# Altium project Zenith 2U.PrjPcb
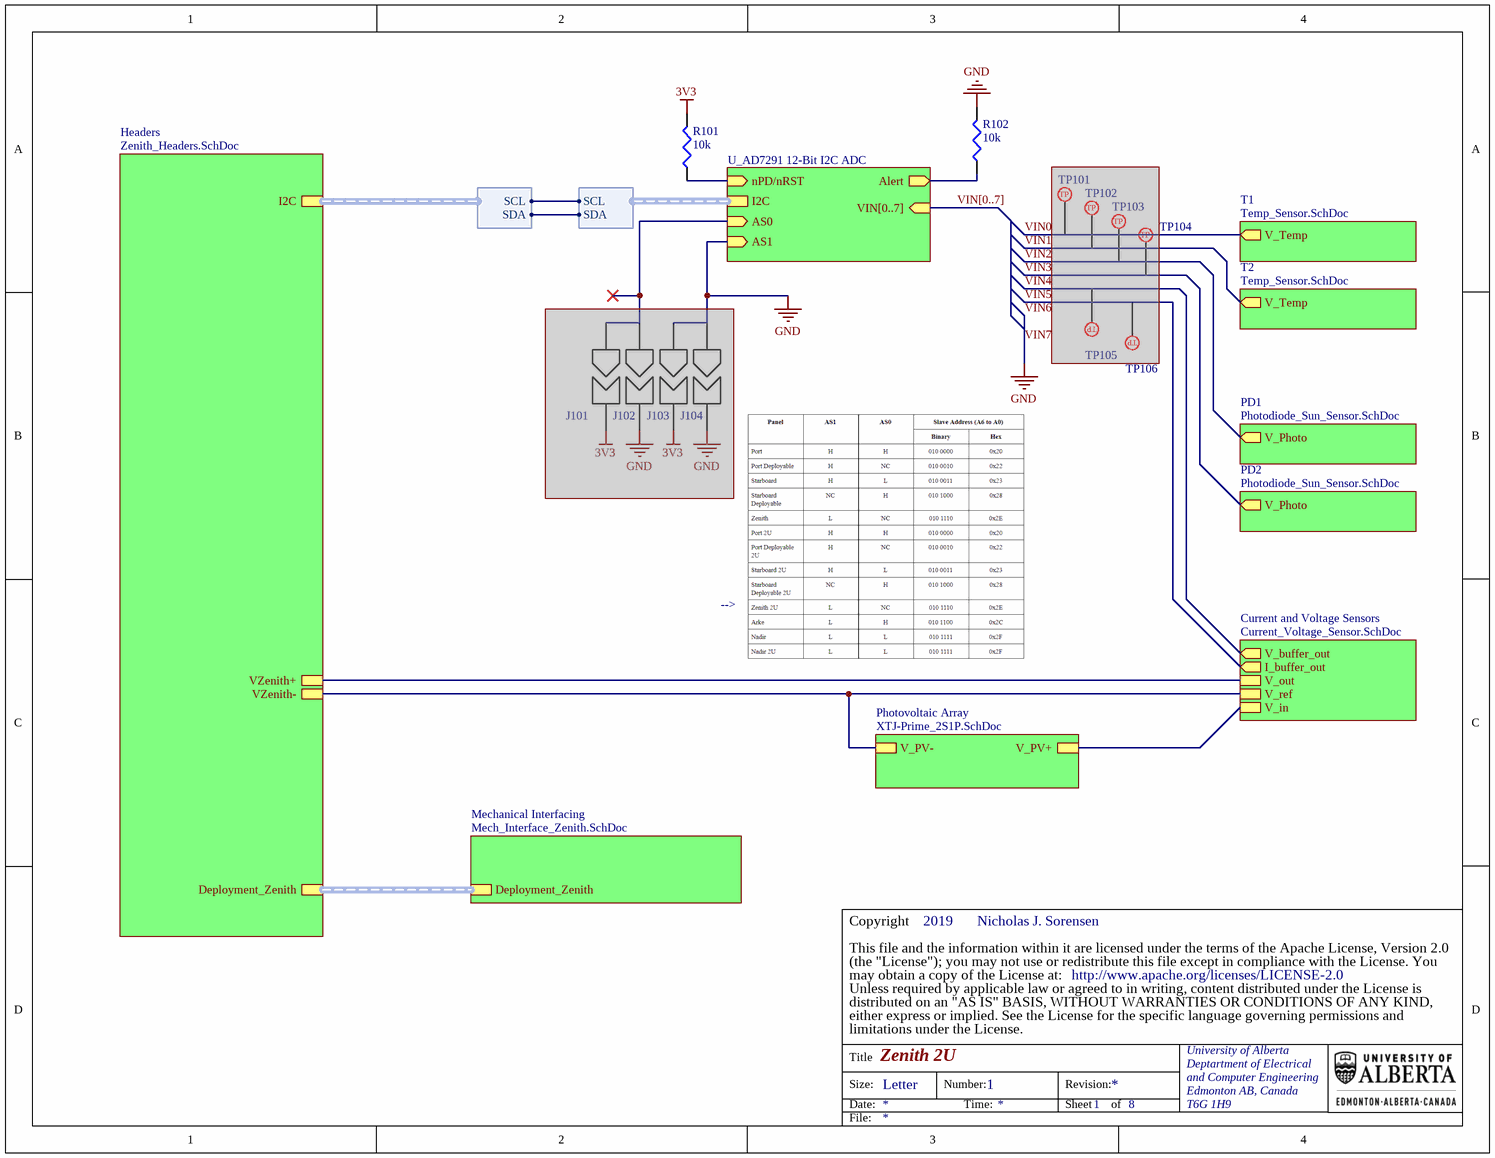
[diagram p0: Zenith 2U.SchDoc]
ProjectVersion: 4.02; SVNVersion: 3196
3 sheets, 30 parts. Net scope: hierarchical (ports join the sheet entries above them; power ports are global).
Board file: Zenith Solar Panel 2U.PcbDoc
Sheets:
  Zenith 2U.SchDoc
    Mechanical Interfacing = Mech_Interface_Zenith.SchDoc
    Headers = Zenith_Headers.SchDoc

## Sheet Zenith 2U.SchDoc: Zenith 2U
size Letter; Author: Nicholas J. Sorensen; DocumentNumber: 1; SheetNumber: 1; SheetTotal: 8; CopyrightYear: 2019

### Parts
J101  Jumping Pad  [Jumping Pad]  (value not drawn)  (masked out: inside a compile mask, not in the netlist)
J102  Jumping Pad  [Jumping Pad]  (value not drawn)  (masked out: inside a compile mask, not in the netlist)
J103  Jumping Pad  [Jumping Pad]  (value not drawn)  (masked out: inside a compile mask, not in the netlist)
J104  Jumping Pad  [Jumping Pad]  (value not drawn)  (masked out: inside a compile mask, not in the netlist)
R101  value 10k  [VSH-0603MCT]  (hidden comment: Res3)
R102  value 10k  [VSH-0603MCT]  (hidden comment: Res3)
TP101  5017  [KS-5017]  (value not drawn)  (masked out: inside a compile mask, not in the netlist)
TP102  5017  [KS-5017]  (value not drawn)  (masked out: inside a compile mask, not in the netlist)
TP103  5017  [KS-5017]  (value not drawn)  (masked out: inside a compile mask, not in the netlist)
TP104  5017  [KS-5017]  (value not drawn)  (masked out: inside a compile mask, not in the netlist)
TP105  5017  [KS-5017]  (value not drawn)  (masked out: inside a compile mask, not in the netlist)
TP106  5017  [KS-5017]  (value not drawn)  (masked out: inside a compile mask, not in the netlist)

### Sub-sheets
Current and Voltage Sensors = Current_Voltage_Sensor.SchDoc (file not in this document): V_out, V_ref, V_in, I_buffer_out (out), V_buffer_out (out)
Headers = Zenith_Headers.SchDoc: I2C (harness I2C), VZenith+, Deployment_Zenith (harness Deployment_Zenith), VZenith-
Mechanical Interfacing = Mech_Interface_Zenith.SchDoc: Deployment_Zenith (harness Deployment_Zenith)
PD1 = Photodiode_Sun_Sensor.SchDoc (file not in this document): V_Photo (out)
PD2 = Photodiode_Sun_Sensor.SchDoc (file not in this document): V_Photo (out)
Photovoltaic Array = XTJ-Prime_2S1P.SchDoc (file not in this document): V_PV+, V_PV-
T1 = Temp_Sensor.SchDoc (file not in this document): V_Temp (out)
T2 = Temp_Sensor.SchDoc (file not in this document): V_Temp (out)
U_AD7291 12-Bit I2C ADC = AD7291 12-Bit I2C ADC.SchDoc (file not in this document): nPD/nRST (in), Alert (out), VIN[0..7] (in), AS0 (in), AS1 (in), I2C (harness I2C)

### Harnesses
I2C: SCL, SDA

### Nets
3V3: R101.2
VIN6: R102.2 ; sheet U_AD7291 12-Bit I2C ADC/AS1  [also labelled GND, VIN7]
SCL: sheet U_AD7291 12-Bit I2C ADC/I2C.SCL, sheet Headers/I2C.SCL
SDA: sheet U_AD7291 12-Bit I2C ADC/I2C.SDA, sheet Headers/I2C.SDA
VIN0: sheet T1/V_Temp
VIN1: sheet T2/V_Temp
VIN2: sheet PD1/V_Photo
VIN3: sheet PD2/V_Photo
VIN4: sheet Current and Voltage Sensors/V_buffer_out
VIN5: sheet Current and Voltage Sensors/I_buffer_out
NetP803_1: sheet Photovoltaic Array/V_PV-, sheet Current and Voltage Sensors/V_ref, sheet Headers/VZenith-
NetP803_3: sheet Current and Voltage Sensors/V_out, sheet Headers/VZenith+
NetR101_1: R101.1 ; sheet U_AD7291 12-Bit I2C ADC/nPD/nRST
NetR102_1: R102.1 ; sheet U_AD7291 12-Bit I2C ADC/Alert
(unnamed): sheet Photovoltaic Array/V_PV+, sheet Current and Voltage Sensors/V_in

### Buses and harness runs
bus VIN[0..7] = sheet U_AD7291 12-Bit I2C ADC/VIN[0..7]
harness sheet Headers/Deployment_Zenith = sheet Mechanical Interfacing/Deployment_Zenith

### Notes on the sheet
- -->
- (the "License"); you may not use or redistribute this file except in compliance with the License. You
- This file and the information within it are licensed under the terms of the Apache License, Version 2.0
- Copyright
- Unless required by applicable law or agreed to in writing, content distributed under the License is
- distributed on an "AS IS" BASIS, WITHOUT WARRANTIES OR CONDITIONS OF ANY KIND,
- either express or implied. See the License for the specific language governing permissions and
- limitations under the License.
- may obtain a copy of the License at:
- http://www.apache.org/licenses/LICENSE-2.0
- Title
- Size:
- Date:
- Letter
- Number:
- Time:
- Revision:
- Sheet
- of
- University of Alberta
- Deptartment of Electrical
- and Computer Engineering
- Edmonton AB, Canada
- T6G 1H9
- File:
- (in symbol PTP-KS-00001) TP

### Library data of the parts
J101-J104 = PXX-ABS-00011: Manufacturer Part Number: Custom; Index: 11; Designator: J?; Part Number: PXX-ABS-00011; Supplier 1: Digi-key; Publisher: AlbertaSat; LatestRevisionNote: ...
R101 R102 = PR-VSH-00143: RES SMD 10K OHM 1% 1/8W 0603; Manufacturer Part Number: MCT06030C1002FP500; Index: 143; Designator: R?; Temperature Coefficient: ±50ppm/°C; Published: 3/14/2016; LatestRevisionDate: 3/14/2016; LatestRevisionNote: ...; PackageReference: 0603 (1608 Metric); Publisher: AlbertaSat; PackageDescription: Chip Resistor, 2-Leads, Body 1.55x0.85mm, IPC Low Density; Part Number: PR-VSH-00143; Supplier Part Number 1: MCT0603-10.0K-CFCT-ND; Supplier 1: Digi-key; Supplier Link: http://www.digikey.ca/product-search/en?keywords=MCT0603-10.0K-CFCT-ND; Tolerance: ±1%; Power - Rated: 1/8W; Applications: General Purpose
TP101-TP106 = PTP-KS-00001: PC TEST POINT MINI SMD; Index: 1; Supplier 1: Digi-key; Supplier 2: Newark; Supplier 3: Mouser; Part Number: PTP-KS-00001; Manufacturer Part Number: 5017; Supplier Part Number 1: 36-5017CT-ND; Publisher: AlbertaSat; Published: 3/15/2016; LatestRevisionDate: 3/15/2016; LatestRevisionNote: ...; PackageReference: KS-5017; PackageDescription: Testpoint Lug Mini SMD 27X10X152; Supplier Link: http://www.digikey.ca/product-detail/en/keystone-electronics/5017/36-5017TR-ND/2217304

## Sheet Mech_Interface_Zenith.SchDoc: Mech_Interface_Zenith
size Letter; Author: Nicholas J. Sorensen, and Erik F. Halliwell; Engineer: Nicholas J. Sorensen, and Erik F. Halliwell; DocumentNumber: 7; SheetNumber: 7; SheetTotal: 8
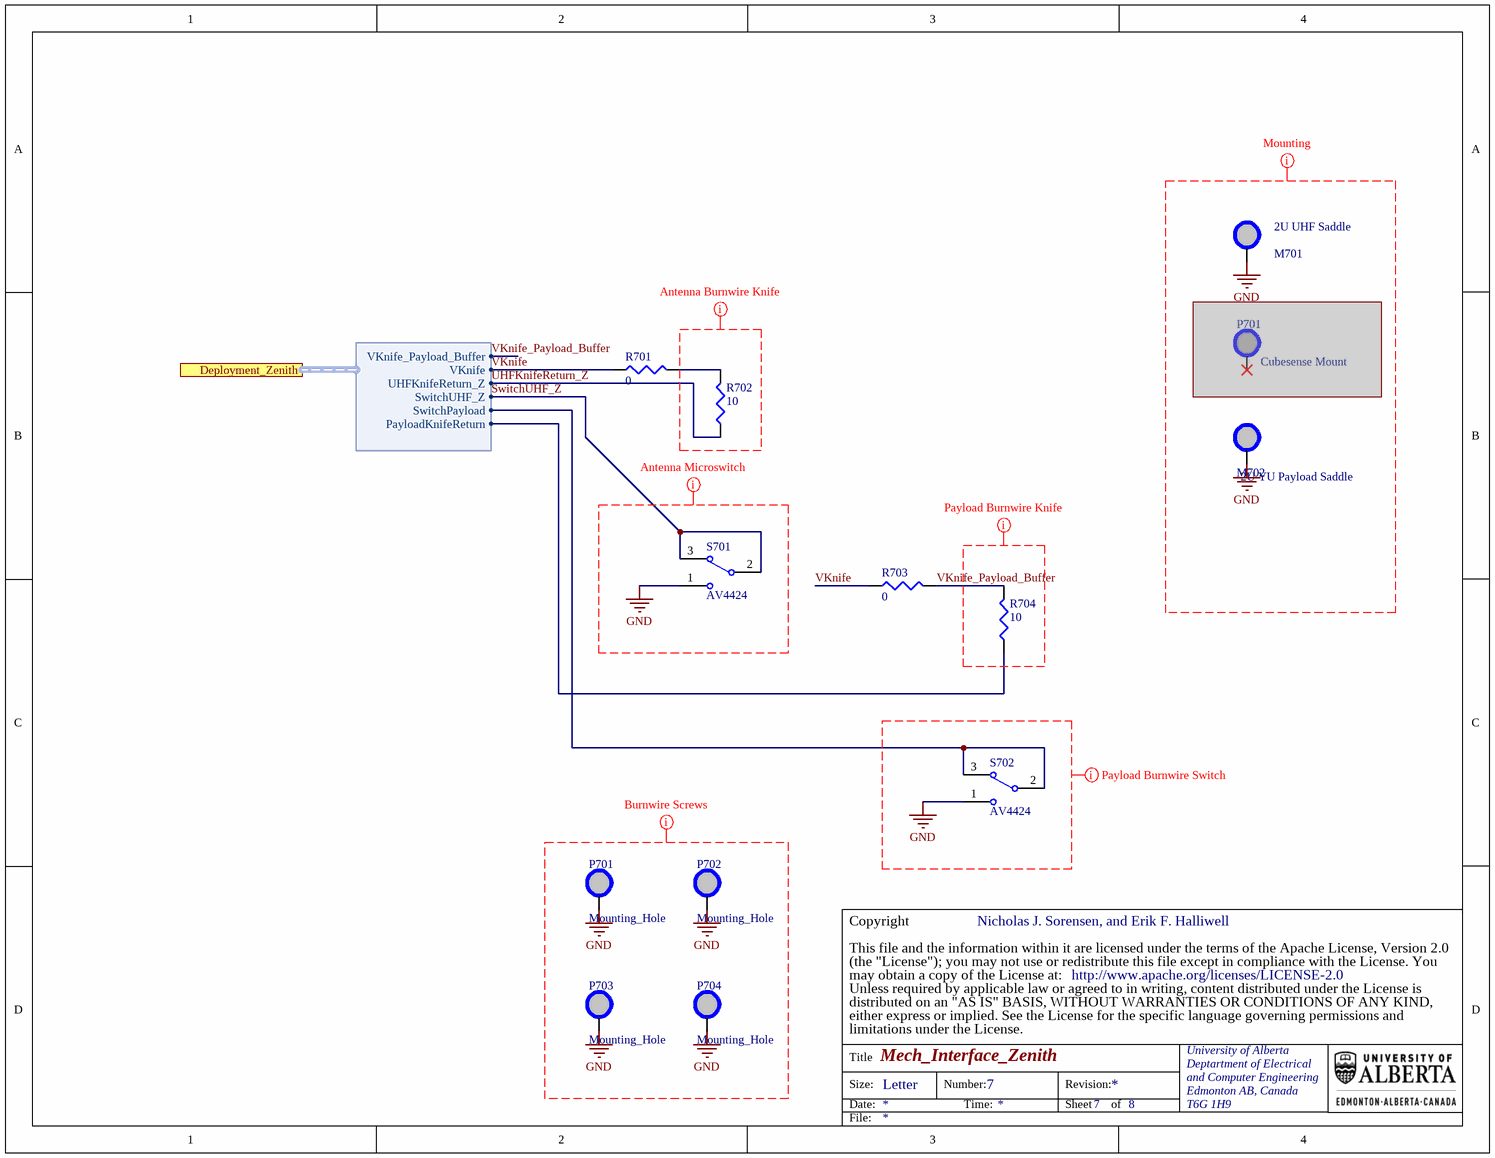
[diagram p1: Mech_Interface_Zenith.SchDoc]

### Parts
(Parts that share a designator on the sheet are numbered #1, #2 ... from top to bottom, then left to right.)
M701  2U UHF Saddle  [2U_ANTENNA_SADDLE]
M702  2U YU Payload Saddle  [2U_YU_Saddle]
P701#1  Cubesense Mount  [Cubesense_Mount]  (masked out: inside a compile mask, not in the netlist)
P701#2  Mounting_Hole  [Burnwire_Screw]
P702  Mounting_Hole  [Burnwire_Screw]
P703  Mounting_Hole  [Burnwire_Screw]
P704  Mounting_Hole  [Burnwire_Screw]
R701  value 0  [PANA-ERJ3G]  (hidden comment: Jumper)
R702  value 10  [VSH-CPF1]  (hidden comment: Res3)
R703  value 0  [PANA-ERJ3G]  (hidden comment: Jumper)
R704  value 10  [VSH-CPF1]  (hidden comment: Res3)
S701  AV4424  [PANA-AV4424]
S702  AV4424  [PANA-AV4424]

### Ports
Deployment_Zenith (harness Deployment_Zenith)

### Harnesses
Deployment_Zenith: UHFKnifeReturn_Z, VKnife, SwitchUHF_Z, SwitchPayload, PayloadKnifeReturn, VKnife_Payload_Buffer

### Nets
GND: M701.1 M702.1 P701#2.1 P702.1 P703.1 P704.1 S701.1(NO) S702.1(NO)  [project net VIN6]
PayloadKnifeReturn: R704.1 ; port Deployment_Zenith.PayloadKnifeReturn
SwitchPayload: S702.2(COM) S702.3(NC) ; port Deployment_Zenith.SwitchPayload
SwitchUHF_Z: S701.2(COM) S701.3(NC) ; port Deployment_Zenith.SwitchUHF_Z
UHFKnifeReturn_Z: R702.1 ; port Deployment_Zenith.UHFKnifeReturn_Z
VKnife: R701.1 R703.1 ; port Deployment_Zenith.VKnife
VKnife_Payload_Buffer: R703.2 R704.2 ; port Deployment_Zenith.VKnife_Payload_Buffer
NetR701_2: R701.2 R702.2

### Layout directives
mark named Antenna Burnwire Knife: (no net found under the mark)
mark named Antenna Microswitch: GND
mark named Mounting: GND
mark named Burnwire Screws: GND
mark named Payload Burnwire Knife: (no net found under the mark)
mark named Payload Burnwire Switch: GND

### Notes on the sheet
- (the "License"); you may not use or redistribute this file except in compliance with the License. You
- This file and the information within it are licensed under the terms of the Apache License, Version 2.0
- Copyright
- Unless required by applicable law or agreed to in writing, content distributed under the License is
- distributed on an "AS IS" BASIS, WITHOUT WARRANTIES OR CONDITIONS OF ANY KIND,
- either express or implied. See the License for the specific language governing permissions and
- limitations under the License.
- may obtain a copy of the License at:
- http://www.apache.org/licenses/LICENSE-2.0
- Title
- Size:
- Date:
- Letter
- Number:
- Time:
- Revision:
- Sheet
- of
- University of Alberta
- Deptartment of Electrical
- and Computer Engineering
- Edmonton AB, Canada
- T6G 1H9
- File:

### Library data of the parts
M701 = PXX-ABS-00012: Saddle for the UHF antennas to be seated in.; Manufacturer Part Number: Custom; Index: 13; Designator: M?; Part Number: PXX-ABS-00012; Supplier 1: Digi-key; Publisher: AlbertaSat; LatestRevisionNote: ...
M702 = PXX-ABS-00020: Manufacturer Part Number: Custom; Index: 20; Designator: M?; Part Number: PXX-ABS-00020; Supplier 1: Digi-key; Publisher: AlbertaSat; LatestRevisionNote: ...
P701#1 = PXX-ABS-00006: Manufacturer Part Number: Custom; Index: 6; Designator: P?; Part Number: PXX-ABS-00006; Supplier 1: Digi-key; Publisher: AlbertaSat; LatestRevisionNote: ...
P701#2 P702-P704 = PXX-ABS-00015: Manufacturer Part Number: Custom; Index: 15; Designator: M?; Part Number: PXX-ABS-00015; Supplier 1: Digi-key; Publisher: AlbertaSat; LatestRevisionNote: ...
R701 R703 = 13128: RES SMD 0.0OHM JUMPER 1/10W 0603; Part Number: 13128; Manufacturer Part Number: ERJ-3GEY0R00V; Designator: R?; Power: 0.1W, 1/10W; PackageDescription: Chip Resistor, 2-Leads, Body 1.60x0.80mm, IPC Low Density; Supplier Part Number 1: P0.0GCT-ND; Supplier 1: Digi-Key; Supplier Link: http://www.digikey.ca/product-search/en?keywords=P0.0GCT-ND; PackageReference: 0603 (1608 Metric); Tolerance: Jumper; Temperature Coefficient: -; Type: Jumper
R702 R704 = PR-VSH-00317: 21 Ohms ±1% 1W Through Hole Resistor Axial Flame Proof, Moisture Resistant, Safety Metal Film; Manufacturer Part Number: CPF121R000FKEE6; Index: 317; Designator: R?; Temperature Coefficient: ±100ppm/°C; Published: 2/27/2020; LatestRevisionDate: 2/27/2020; LatestRevisionNote: ...; PackageReference: VSH-CPF1; Publisher: AlbertaSat; PackageDescription: Chip Resistor; Part Number: PR-VSH-00317; Supplier Part Number 1: CPF21.0CCT-ND; Supplier 1: Digi-key; Supplier Link: #https://www.digikey.ca/product-detail/en/vishay-dale/CPF121R000FKEE6/CPF21.0CCT-ND/2713126#; Tolerance: ±1%; Power - Rated: 1W
S701 S702 = 20035: SWITCH SNAP ACT SPDT 500MA 30V; Part Number: 20035; Manufacturer Part Number: AV4424; Supplier Part Number 1: 255-3743-ND; Supplier 1: Digi-Key; Supplier Link: #https://www.digikey.com/product-detail/en/panasonic-electric-works/AV4424/255-3743-ND/646766#

## Sheet Zenith_Headers.SchDoc: Zenith_Headers
size Letter; Author: Nicholas J. Sorensen, and Erik F. Halliwell; Engineer: Nicholas J. Sorensen, and Erik F. HalliwellNicholas Sorensen, and Erik Halliwell; DocumentNumber: 8; SheetNumber: 8; SheetTotal: 8
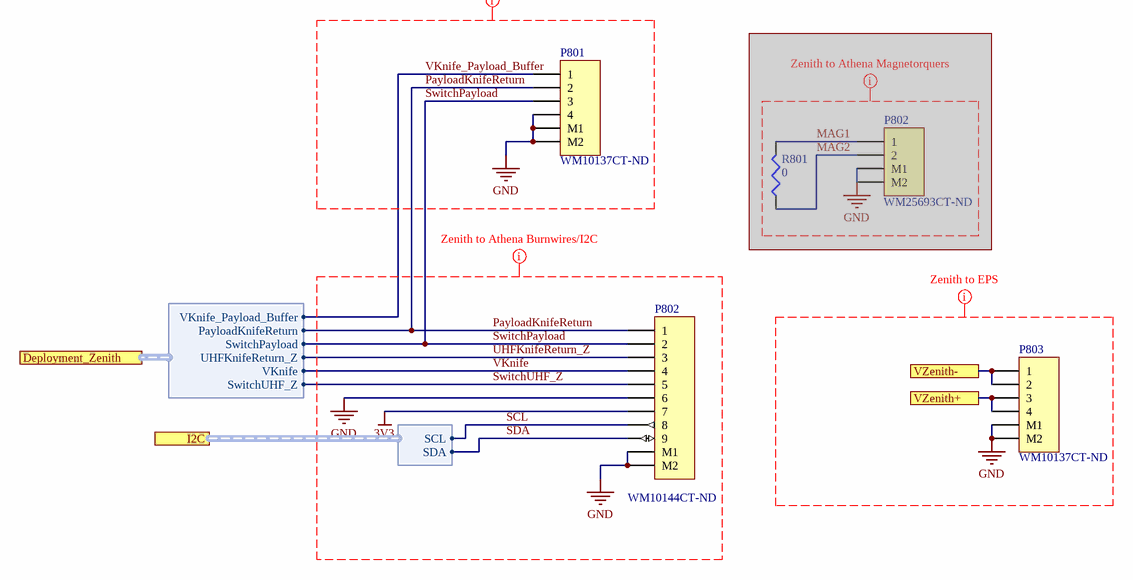
[diagram p2: Zenith_Headers.SchDoc]

### Parts
(Parts that share a designator on the sheet are numbered #1, #2 ... from top to bottom, then left to right.)
P801  WM10137CT-ND  [MOLX-5040500491]
P802#1  WM25693CT-ND  [MOLX-5040500291]  (masked out: inside a compile mask, not in the netlist)
P802#2  WM10144CT-ND  [MOLX-5040500991]
P803  WM10137CT-ND  [MOLX-5040500491]
R801  value 0  [VSH-0805MCU]  (hidden comment: Res3)  (masked out: inside a compile mask, not in the netlist)

### Ports
Deployment_Zenith (harness Deployment_Zenith), I2C (harness I2C), VZenith+, VZenith-

### Harnesses
Deployment_Zenith: UHFKnifeReturn_Z, VKnife, SwitchUHF_Z, SwitchPayload, PayloadKnifeReturn, VKnife_Payload_Buffer
I2C: SCL, SDA

### Nets
3V3: P802#2.7
GND: P801.4 P801.M1 P801.M2 P802#2.6 P802#2.M1 P802#2.M2 P803.M1 P803.M2  [project net VIN6]
PayloadKnifeReturn: P801.2 P802#2.1 ; port Deployment_Zenith.PayloadKnifeReturn
SCL: P802#2.8 ; port I2C.SCL
SDA: P802#2.9 ; port I2C.SDA
SwitchPayload: P801.3 P802#2.2 ; port Deployment_Zenith.SwitchPayload
SwitchUHF_Z: P802#2.5 ; port Deployment_Zenith.SwitchUHF_Z
UHFKnifeReturn_Z: P802#2.3 ; port Deployment_Zenith.UHFKnifeReturn_Z
VKnife: P802#2.4 ; port Deployment_Zenith.VKnife
VKnife_Payload_Buffer: P801.1 ; port Deployment_Zenith.VKnife_Payload_Buffer
NetP803_1: P803.1 P803.2 ; port VZenith-
NetP803_3: P803.3 P803.4 ; port VZenith+

### Layout directives
mark named Zenith to EPS: GND
mark named Zenith to Athena Magnetorquers: GND, MAG1, MAG2
mark named Zenith to Athena Burnwires/I2C: 3V3, GND, PayloadKnifeReturn, SCL, SDA, SwitchPayload, SwitchUHF_Z, UHFKnifeReturn_Z, VKnife
mark named Zenith to Payload: GND, PayloadKnifeReturn, SwitchPayload, VKnife_Payload_Buffer

### Notes on the sheet
- (the "License"); you may not use or redistribute this file except in compliance with the License. You
- This file and the information within it are licensed under the terms of the Apache License, Version 2.0
- Copyright
- Unless required by applicable law or agreed to in writing, content distributed under the License is
- distributed on an "AS IS" BASIS, WITHOUT WARRANTIES OR CONDITIONS OF ANY KIND,
- either express or implied. See the License for the specific language governing permissions and
- limitations under the License.
- may obtain a copy of the License at:
- http://www.apache.org/licenses/LICENSE-2.0
- Title
- Size:
- Date:
- Letter
- Number:
- Time:
- Revision:
- Sheet
- of
- University of Alberta
- Deptartment of Electrical
- and Computer Engineering
- Edmonton AB, Canada
- T6G 1H9
- File:

### Library data of the parts
P801 P803 = 63: CONN HEADER SMD R/A 4POS 1.5MM; Part Number: 63; Manufacturer Part Number: 5040500491; Designator: P?; LatestRevisionDate: 17-Jul-2002; LatestRevisionNote: Re-released for DXP Platform.; Publisher: Altium Limited; Supplier Part Number 1: WM10137CT-ND; Supplier 1: Digi-Key; Supplier Link: #https://www.digikey.ca/product-detail/en/molex/5040500491/WM10137CT-ND/4357653#
P802#1 = 61: CONN HEADER SMD R/A 2POS 1.5MM; Part Number: 61; Manufacturer Part Number: 5040500291; Designator: P?; LatestRevisionDate: 17-Jul-2002; LatestRevisionNote: Re-released for DXP Platform.; Publisher: Altium Limited; Supplier Part Number 1: WM25693CT-ND; Supplier 1: Digi-Key; Supplier Link: #https://www.digikey.ca/product-detail/en/molex/5040500291/WM25693CT-ND/9954119#
P802#2 = 68: CONN HEADER SMD R/A 9POS 1.5MM; Part Number: 68; Manufacturer Part Number: 5040500991; Designator: P?; LatestRevisionDate: 17-Jul-2002; LatestRevisionNote: Re-released for DXP Platform.; Publisher: Altium Limited; Supplier Part Number 1: WM25695CT-ND; Supplier 1: Digi-Key; Supplier Link: #https://www.digikey.ca/product-detail/en/molex/5040500991/WM25695CT-ND/9954121#
R801 = PR-VSH-00003: RES SMD 0.0 OHM JUMPER 1/5W 0805; Manufacturer Part Number: MCU08050Z0000ZP500; Index: 3; Designator: R?; Published: 3/14/2016; LatestRevisionDate: 3/14/2016; LatestRevisionNote: ...; PackageReference: 0805 (2012 Metric); Publisher: AlbertaSat; PackageDescription: Chip Resistor, 2-Leads, Body 2.00x1.25mm, IPC Low Density; Part Number: PR-VSH-00003; Supplier Part Number 1: MCU0805-0.0-ZZCT-ND; Supplier 1: Digi-key; Supplier Link: http://www.digikey.ca/product-search/en?keywords=MCU0805-0.0-ZZCT-ND; Tolerance: Jumper; Power - Rated: 1/5W; Temperature Coefficient: -; Applications: General Purpose

## Nets that join several sheets
3V3: Zenith 2U (R101.2), Zenith_Headers (P802#2.7)
VIN6: Zenith 2U (R102.2), Mech_Interface_Zenith (8 pins), Zenith_Headers (8 pins)
PayloadKnifeReturn: Mech_Interface_Zenith (R704.1), Zenith_Headers (P801.2 P802#2.1)
SwitchPayload: Mech_Interface_Zenith (S702.2 S702.3), Zenith_Headers (P801.3 P802#2.2)
SwitchUHF_Z: Mech_Interface_Zenith (S701.2 S701.3), Zenith_Headers (P802#2.5)
UHFKnifeReturn_Z: Mech_Interface_Zenith (R702.1), Zenith_Headers (P802#2.3)
VKnife: Mech_Interface_Zenith (R701.1 R703.1), Zenith_Headers (P802#2.4)
VKnife_Payload_Buffer: Mech_Interface_Zenith (R703.2 R704.2), Zenith_Headers (P801.1)